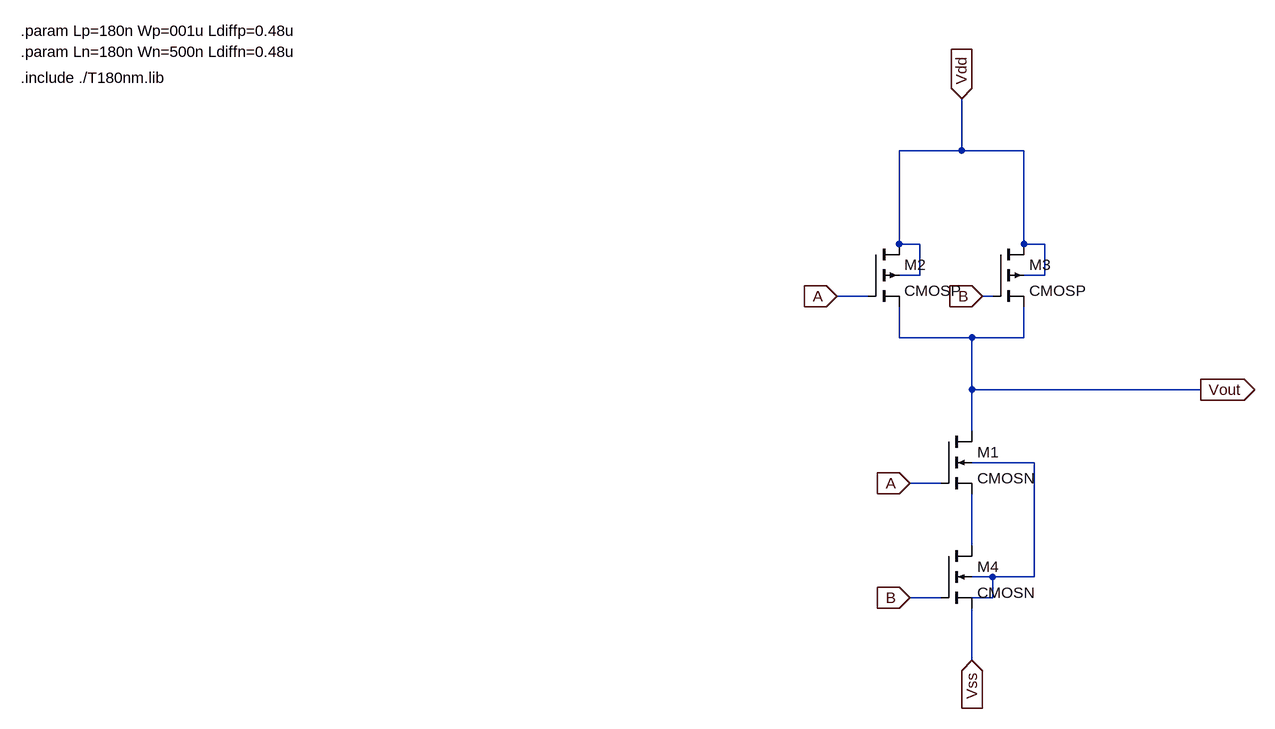
[diagram p0: schematic nand.asc]
nand.asc, the LTspice schematic file:
Version 4
SHEET 1 880 712
WIRE 208 -240 208 -320
WIRE 208 -240 112 -240
WIRE 304 -240 208 -240
WIRE 112 -96 112 -240
WIRE 144 -96 112 -96
WIRE 304 -96 304 -240
WIRE 336 -96 304 -96
WIRE 304 -80 304 -96
WIRE 144 -48 144 -96
WIRE 144 -48 112 -48
WIRE 336 -48 336 -96
WIRE 336 -48 304 -48
WIRE 64 -16 16 -16
WIRE 256 -16 240 -16
WIRE 112 48 112 0
WIRE 224 48 112 48
WIRE 304 48 304 0
WIRE 304 48 224 48
WIRE 224 128 224 48
WIRE 576 128 224 128
WIRE 224 192 224 128
WIRE 320 240 224 240
WIRE 176 272 128 272
WIRE 224 368 224 288
WIRE 256 416 224 416
WIRE 320 416 320 240
WIRE 320 416 256 416
WIRE 176 448 128 448
WIRE 256 448 256 416
WIRE 256 448 224 448
WIRE 224 544 224 464
FLAG 576 128 Vout
IOPIN 576 128 Out
FLAG 208 -320 Vdd
IOPIN 208 -320 In
FLAG 224 544 Vss
IOPIN 224 544 In
FLAG 16 -16 A
IOPIN 16 -16 In
FLAG 128 272 A
IOPIN 128 272 In
FLAG 128 448 B
IOPIN 128 448 In
FLAG 240 -16 B
IOPIN 240 -16 In
SYMBOL nmos4 176 192 R0
SYMATTR InstName M1
SYMATTR Value CMOSN
SYMATTR Value2 l={Ln} w={Wn} ad={Ldiffn*Wn} as={Ldiffn*Wn} pd={2*Ldiffn+Wn} ps={2*Ldiffn+Wn}
SYMBOL pmos4 64 -96 R0
SYMATTR InstName M2
SYMATTR Value CMOSP
SYMATTR Value2 l={Lp} w={Wp} ad={Ldiffp*Wp} as={Ldiffp*Wp} pd={2*Ldiffp+Wp} ps={2*Ldiffp+Wp}
SYMBOL pmos4 256 -96 R0
SYMATTR InstName M3
SYMATTR Value CMOSP
SYMATTR Value2 l={Lp} w={Wp} ad={Ldiffp*Wp} as={Ldiffp*Wp} pd={2*Ldiffp+Wp} ps={2*Ldiffp+Wp}
SYMBOL nmos4 176 368 R0
SYMATTR InstName M4
SYMATTR Value CMOSN
SYMATTR Value2 l={Ln} w={Wn} ad={Ldiffn*Wn} as={Ldiffn*Wn} pd={2*Ldiffn+Wn} ps={2*Ldiffn+Wn}
TEXT -1240 -352 Left 2 !.include ./T180nm.lib
TEXT -1240 -424 Left 2 !.param Lp=180n Wp=001u Ldiffp=0.48u
TEXT -1240 -392 Left 2 !.param Ln=180n Wn=500n Ldiffn=0.48u

The netlist it stands for:
* nand.asc
M1 Vout A N002 N001 CMOSN l={Ln} w={Wn} ad={Ldiffn*Wn} as={Ldiffn*Wn} pd={2*Ldiffn+Wn} ps={2*Ldiffn+Wn}
M2 Vdd A Vout Vdd CMOSP l={Lp} w={Wp} ad={Ldiffp*Wp} as={Ldiffp*Wp} pd={2*Ldiffp+Wp} ps={2*Ldiffp+Wp}
M3 Vdd B Vout Vdd CMOSP l={Lp} w={Wp} ad={Ldiffp*Wp} as={Ldiffp*Wp} pd={2*Ldiffp+Wp} ps={2*Ldiffp+Wp}
M4 N002 B Vss N001 CMOSN l={Ln} w={Wn} ad={Ldiffn*Wn} as={Ldiffn*Wn} pd={2*Ldiffn+Wn} ps={2*Ldiffn+Wn}
.model NMOS NMOS
.model PMOS PMOS
.lib standard.mos
.include ./T180nm.lib
.param Lp=180n Wp=001u Ldiffp=0.48u
.param Ln=180n Wn=500n Ldiffn=0.48u
.backanno
.end